# EAGLE design TinUI v1 (EAGLE 9.2.2)
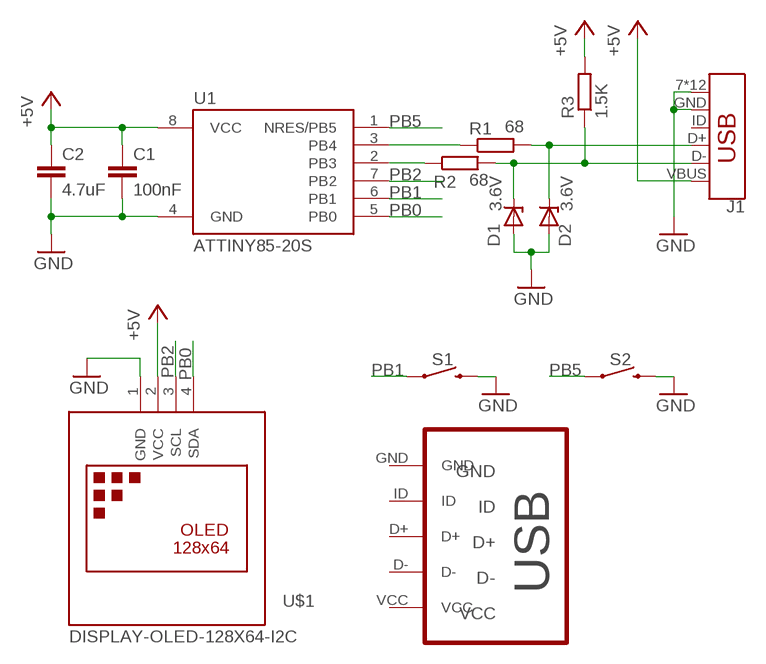
[diagram p0: schematic, sheet 1]

## Parts
C1  100nF  C-EUC0603  [C0603]
C2  4.7uF  C-EUC0603  [C0603]
D1  3.6V  ZENER-DIODESOD80C  [SOD80C]
D2  3.6V  ZENER-DIODESOD80C  [SOD80C]
J1  AMP FCI 10103594-0001LF  USB_MICRO-B_HALF_PTH  [USB-MICROB-PTH]
R1  68  R-EU_R0603  [R0603]
R2  68  R-EU_R0603  [R0603]
R3  1.5K  R-EU_R0603  [R0603]
S1  MOMENTARY-SWITCH-SPST-SMD-6.0X3.5MM  [TACTILE_SWITCH_SMD_6.0X3.5MM]
S2  MOMENTARY-SWITCH-SPST-SMD-6.0X3.5MM  [TACTILE_SWITCH_SMD_6.0X3.5MM]
U1  ATTINY85-20S  [SOIC8_EIAJ_208MIL]
U$1  DISPLAY-OLED-128X64-I2C  [DISPLAY-OLED-128X64-I2C]
U$2  MICRO-USB-B  [MICRO_USB_4_LEGS]

## Nets
+5V: C1.1 C2.1 J1.VBUS R3.2 U1.8(VCC) U$1.2(VCC)
GND: C1.2 C2.2 D1.A D2.A J1.7(SHIELD) J1.GND J1.SHEILD2(SHIELD) J1.SHIELD J1.SHIELD3(SHIELD) J1.SHIELD4(SHIELD) J1.SHIELD5(SHIELD) J1.SHIELD6(SHIELD) J1.SHIELD8(SHIELD) J1.SHIELD9(SHIELD) J1.SHIELD10(SHIELD) J1.SHIELD11(SHIELD) J1.SHIELD12(SHIELD) S1.2 S2.2 U1.4(GND) U$1.1(GND)
N$1: R1.1 U1.3(PB4)
N$2: R2.1 U1.2(PB3)
N$3: D2.C J1.D+ R1.2
N$4: D1.C J1.D- R2.2 R3.1
PB0: U1.5(PB0) U$1.4(SDA)
PB1: S1.1 U1.6(PB1)
PB2: U1.7(PB2) U$1.3(SCL)
PB5: S2.1 U1.1(NRES/PB5)
Unconnected: J1.ID U$2.D+ U$2.D- U$2.GND U$2.ID U$2.VCC

## Library data of the parts
C1 C2 = rcl:C-EU: CAPACITOR, European symbol; SPICEPREFIX: C
D1 D2 = diode:ZENER-DIODE: Z-Diode
J1 = SparkFun-Connectors:USB_MICRO-B: USB Type Micro-B Connector Male/female and PTH/SMT variants SparkFun Products: SparkFun microB USB Breakout <https://www.sparkfun.com/products/12035> SparkFun USB microB Plug Breakout <https://www.sparkfun.com/products/10031> SparkFun ESP8266 Thing <https://www.sparkfun.com/products/13231>; PROD_ID: CONN-13711
R1-R3 = rcl:R-EU_: RESISTOR, European symbol; SPICEPREFIX: R
S1 S2 = SparkFun-Switches:MOMENTARY-SWITCH-SPST: Momentary Switch (Pushbutton) - SPST Normally-open (NO) SPST momentary switches (buttons, pushbuttons). Variants PTH-12MM - 12mm square, through-hole Momentary Pushbutton Switch - 12mm Square <https://www.sparkfun.com/products/9190> (COM-09190) PTH-6.0MM, PTH-6.0MM-KIT - 6.0mm square, through-hole Mini Pushbutton Switch <https://www.sparkfun.com/products/97> (COM-00097) KIT package intended for soldering kit's - only one side of pads' copper is exposed. PTH-RIGHT-ANGLE-KIT - Right-angle, through-hole Right Angle Tactile Button <https://www.sparkfun.com/products/10791> - Used on SparkFun BigTime Watch Kit <https://www.sparkfun.com/products/11734> SMD-12MM - 12mm square, surface-mount Tactile Button - SMD (12mm) <https://www.sparkfun.com/products/12993> (COM-12993) Used on SparkFun PicoBoard <https://www.sparkfun.com/products/11888> SMD-4.5MM - 4.5mm Square Trackball Switch Used on SparkFun Blackberry Trackballer Breakout <https://www.sparkfun.com/products/13169> SMD-4.6MMX2.8MM - 4.60mm x 2.80mm, surface mount Used on SparkFun SAMD21 Mini Breakout <https://www.sparkfun.com/products/13664> SMD-5.2MM, SMD-5.2-REDUNDANT - 5.2mm square, surface-mount Mini Pushbutton Switch - SMD <https://www.sparkfun.com/products/8720> (COM-08720) Used on Arduino Pro Mini <https://www.sparkfun.com/products/11114> REDUNDANT package connects both switch circuits together SMD-6.0X3.5MM - 6.0 x 3.5mm, surface mount Momentary Reset Switch SMD <https://www.sparkfun.com/products/8229> (COM-08229) SMD-6.2MM-TALL - 6.2mm square, surface mount Tactile Button - SMD (6mm) <https://www.sparkfun.com/products/12992> Used on SparkFun Digital Sandbox <https://www.sparkfun.com/products/12651> SMD-RIGHT-ANGLE - Right-angle, surface mount Used on SparkFun Block for Intel® Edison - Arduino <https://www.sparkfun.com/products/13036>; PROD_ID: SWCH-00815; SF_SKU: COM-08229
U1 = _hhn_attiny25_45_85:ATTINY85*: ATMEL ATtiny 85 Packages: P = PDIP 08 30mil S = SOIC 08 EIAJ 208mil Technologies Note: for complete ordering code (temp. range, finish, tape&reel etc.) see www.atmel.com • Supply Voltage: V = (1.8…5.5)V | [blank] = (2.7…5.5)V • Speed: 10 = 10 MHz | 20 = 20 MHz Author: Dipl.-Ing. FH Rainer Bayer HHN Hochschule Heilbronn (Heilbronn University), rainer.bayer@hs-heilbronn.de Ingenieurbüro ing-rb, mail@ing-rb.de
U$1 = diy-modules:DISPLAY-OLED-128X64-I2C: 128x64 Dot Matrix OLED Module based on SSD1306 chip Variant with I2C interface More details available here: http://www.instructables.com/id/Monochrome-096-i2c-OLED-display-with-arduino-SSD13/ SSD1306 datasheet: https://cdn-shop.adafruit.com/datasheets/SSD1306.pdf Click here to find device on ebay.com <http://www.ebay.com/sch/oled+display+128x64+iic> Note: There are two variants: I2C and SPI. Search for the proper version.
U$2 = micro usb B - 4LEGS:MICRO-USB-B

## Board
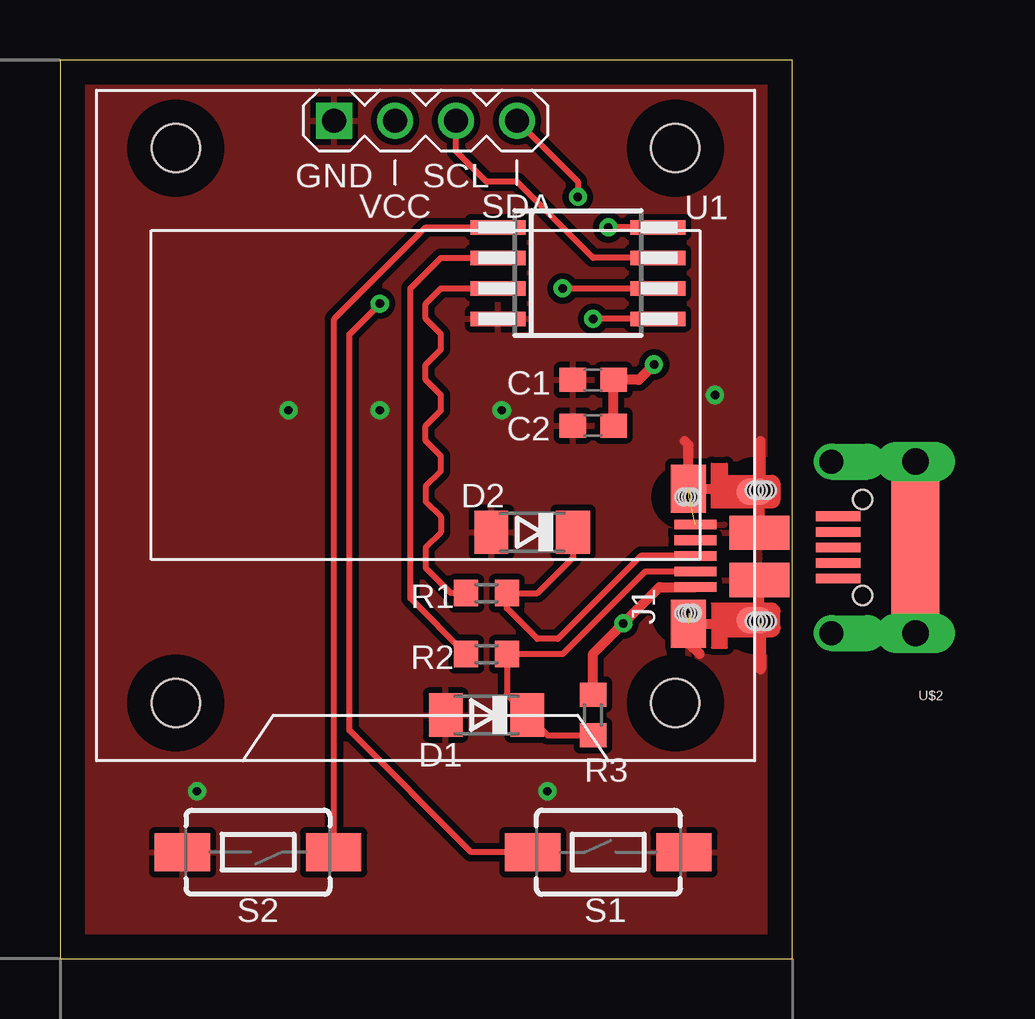
[diagram p1: board, top side]
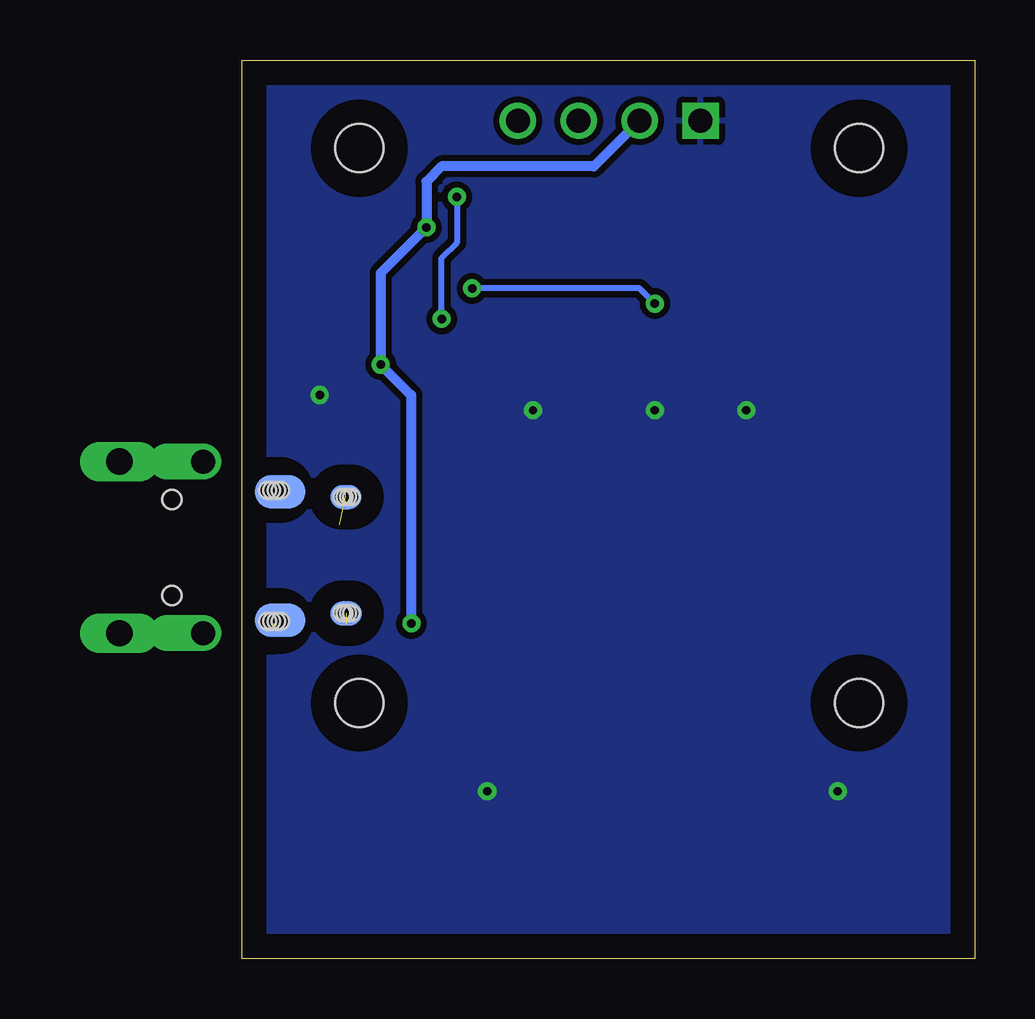
[diagram p2: board, bottom side, seen from below]

Size 30.53 x 37.46 mm. Coordinates in mm from the lower left corner, seen from the top.
Outline: 0,0 30.53,0 30.53,37.46 0,37.46 0,0
Copper layers (1*16): Top 0.035mm / dielectric 1.5mm / Bottom 0.035mm
Design rules "default *": minimum track width 6mil, minimum drill 0.35mm, track to track 10mil, track to pad 10mil, pad to pad 8mil, via to via 10mil, smd to smd 8mil, copper to edge 40mil, drill to drill 6mil, minimum pad ring 10mil, minimum via ring 8mil, stop-mask expansion 4mil, vias tented up to drill 14mil, thermal gap 10mil

### Footprints (pad centres in the part's own frame; a part is rotated, then mirrored left to right if it is on the bottom)
C0603 = smd 1.1 x 1: 1 -0.85,0; 2 0.85,0
SOD80C = smd 1.4 x 1.8: A 1.7,0; C -1.7,0
USB-MICROB-PTH = smd 1.4 x 2.1 bottom: 7 2.701,-1.142; SHIELD5 -2.659,-1.144 | smd 0.4 x 1.75: D+ 0.031,1.331; D- -0.619,1.331; GND 1.331,1.331; ID 0.681,1.331; VBUS -1.269,1.331 | smd 2 x 1.46: SHEILD2 2.831,1.606; SHIELD -2.794,1.606 | smd 1.425 x 2.5: SHIELD3 -0.979,-1.349; SHIELD4 0.996,-1.352 | smd 1.1 x 1.5: SHIELD6 2.701,-1.142; SHIELD8 -2.659,-1.144 | smd 1 x 1.3 bottom: SHIELD9 -2.368,1.604; SHIELD12 2.481,1.598 | smd 1 x 1.3: SHIELD10 -2.368,1.604; SHIELD11 2.487,1.594 | hole 0.7: -2.693,-1.134; -2.693,-1.3; -2.694,-1.499; -2.694,-1.664; 2.768,-1.134; 2.767,-1.303; 2.766,-1.496; 2.766,-1.664 | hole 0.66: -2.359,1.821; -2.349,1.691; -2.359,1.541; -2.354,1.432; 2.481,1.821; 2.491,1.691; 2.481,1.541; 2.486,1.432
R0603 = smd 1 x 1.1: 1 -0.85,0; 2 0.85,0
TACTILE_SWITCH_SMD_6.0X3.5MM = smd 2.3 x 1.6: 1 -3.15,0; 2 3.15,0
SOIC8_EIAJ_208MIL = smd 0.6 x 2.286: 1 -1.905,-3.33; 2 -0.635,-3.33; 3 0.635,-3.33; 4 1.905,-3.33; 5 1.905,3.33; 6 0.635,3.33; 7 -0.635,3.33; 8 -1.905,3.33
DISPLAY-OLED-128X64-I2C = drill 1 square: 1 -3.81,12.7 | drill 1: 2 -1.27,12.7; 3 1.27,12.7; 4 3.81,12.7 | hole 2: -10.414,11.557; 10.414,11.557; 10.414,-11.557; -10.414,-11.557
MICRO_USB_4_LEGS = smd 1.85 x 0.4: D+ 3.125,0; D- 3.125,0.65; GND 3.125,-1.3; ID 3.125,-0.65; VCC 3.125,1.3 | drill 1.1 pad 1.5 long: P$1 -0.1,3.575; P$2 -0.1,-3.575 | drill 1 pad 1.5 offset: P$3 3.4,3.575; P$5 3.4,-3.575 | smd 2 x 6: P$4 -0.1,0 | hole 0.8: 2.1,2; 2.1,-2

### Placement (x,y rotation side)
C1  22.23,24.13 180 top
C2  22.23,22.22 180 top
D1  17.78,10.16 180 top
D2  19.68,17.78 180 top
J1  27.81,16.76 90 top
R1  17.78,15.24 0 top
R2  17.78,12.7 0 top
R3  22.23,10.16 90 top
S1  22.86,4.45 0 top
S2  8.26,4.45 180 top
U1  21.59,28.57 270 top
U$1  15.24,22.22 0 top
U$2  35.56,17.14 180 top

### Tracks (layer width: path | path; a pad name or v marks a point on that pad's centre or on a via)
+5V  (via drill 0.35)
  Top 0.254: U1.8 v22.86,30.48
  Top 0.406: R3.2 22.23,12.72 v23.48,13.98 25,15.5 J1.VBUS | C2.1 C1.1 24.13,24.13 v24.77,24.77
  Bottom 0.406: U$1.2 15.88,33.02 22.23,33.02 22.86,32.39 v22.86,30.48 24.77,28.57 v24.77,24.77 23.5,23.5 23.5,13.99 v23.48,13.98
GND  (via drill 0.35)  (8 unrouted)
  Top 0.406: 26.04,21.59 26.21,21.42 J1.SHEILD2 28.82,19.59 J1.7 | 26.67,12.7 26.21,13.16 J1.SHIELD 29.21,13.97 | 29.21,13.97 | J1.SHIELD3 29.16,14.31 J1.SHIELD5 29.21,13.85 29.21,12.07 | J1.7 29.16,19.26 J1.SHIELD4 | J1.7 29.21,19.72 29.21,21.59
  other vias: 9.53,22.86 13.34,22.86 18.41,22.86 27.3,23.5 20.32,6.99 5.71,6.99
  pour Top: 0,37.47 30.48,37.47 30.48,0 0,0
  pour Bottom: 0,37.47 0,0 30.48,0 30.48,37.47
N$1
  Top 0.254: R1.1 16.3,15.24 15.24,16.29 15.24,17.14 15.88,17.78 15.88,18.41 15.24,19.05 15.24,19.68 15.88,20.32 15.88,20.95 15.24,21.59 15.24,22.22 15.88,22.86 15.88,23.5 15.24,24.13 15.24,24.77 15.88,25.4 15.88,26.04 15.24,26.67 15.24,27.3 15.88,27.94 U1.3
N$2
  Top 0.254: R2.1 14.61,15.02 14.61,27.94 15.88,29.21 U1.2
N$3
  Top 0.254: J1.D+ 24.21,16.79 20.75,13.34 19.9,13.34 18.63,14.61 R1.2 19.9,15.24 21.39,16.72 D2.C
N$4
  Top 0.254: J1.D- 24.4,16.14 20.95,12.7 R2.2 18.63,11.01 D1.C 20.33,9.31 R3.1
PB0  (via drill 0.35)
  Top 0.254: U1.5 v22.23,26.67 | U$1.4 21.59,32.39 v21.59,31.75
  Bottom 0.254: v22.23,26.67 22.23,29.21 21.59,29.85 v21.59,31.75
PB1  (via drill 0.35)
  Top 0.254: S1.1 17.14,4.45 12.06,9.52 12.06,26.04 v13.34,27.3 | v20.95,27.94 U1.6
  Bottom 0.254: v13.34,27.3 13.97,27.94 v20.95,27.94
PB2
  Top 0.254: U1.7 22.23,29.21 19.05,32.39 17.78,32.39 16.51,33.66 U$1.3
PB5
  Top 0.254: S2.1 11.43,4.47 11.43,26.67 15.24,30.48 U1.1